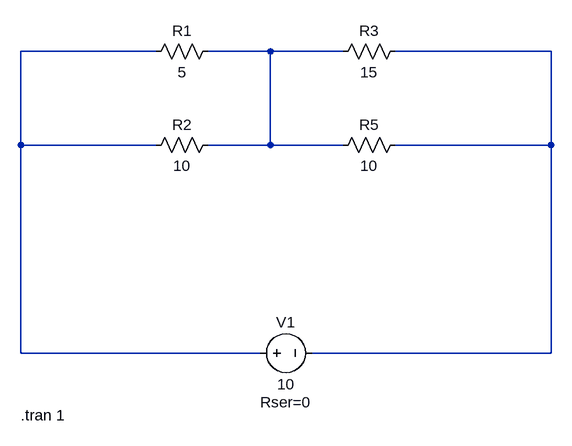
[diagram p0: schematic Draft4.asc]
Draft4.asc, the LTspice schematic file:
Version 4.1
SHEET 1 880 680
WIRE -32 -144 -240 -144
WIRE 144 -144 48 -144
WIRE 256 -144 144 -144
WIRE 576 -144 336 -144
WIRE -240 0 -240 -144
WIRE -32 0 -240 0
WIRE 144 0 144 -144
WIRE 144 0 48 0
WIRE 256 0 144 0
WIRE 576 0 576 -144
WIRE 576 0 336 0
WIRE -240 320 -240 0
WIRE 128 320 -240 320
WIRE 576 320 576 0
WIRE 576 320 208 320
SYMBOL res 64 -160 R90
WINDOW 0 0 56 VBottom 2
WINDOW 3 32 56 VTop 2
SYMATTR InstName R1
SYMATTR Value 5
SYMBOL res 64 -16 R90
WINDOW 0 0 56 VBottom 2
WINDOW 3 32 56 VTop 2
SYMATTR InstName R2
SYMATTR Value 10
SYMBOL res 352 -160 R90
WINDOW 0 0 56 VBottom 2
WINDOW 3 32 56 VTop 2
SYMATTR InstName R3
SYMATTR Value 15
SYMBOL res 352 -16 R90
WINDOW 0 0 56 VBottom 2
WINDOW 3 32 56 VTop 2
SYMATTR InstName R5
SYMATTR Value 10
SYMBOL voltage 112 320 R270
WINDOW 0 32 56 VTop 2
WINDOW 3 -32 56 VBottom 2
WINDOW 123 0 0 Left 0
WINDOW 39 -60 56 VBottom 2
SYMATTR InstName V1
SYMATTR Value 10
SYMATTR SpiceLine Rser=0
TEXT -240 416 Left 2 !.tran 1

The netlist it stands for:
* Draft4.asc
R1 N002 N001 5
R2 N002 N001 10
R3 N003 N002 15
R5 N003 N002 10
V1 N001 N003 10 Rser=0
.tran 1
.backanno
.end